# EAGLE design repeater2 (EAGLE 7.2.0)
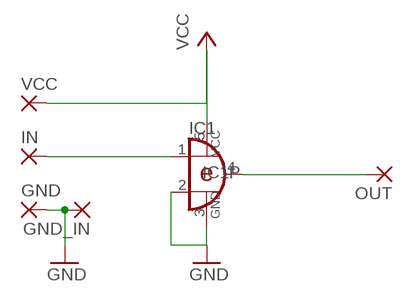
[diagram p0: schematic, sheet 1]

## Parts
GND  SMD2  [SMD1,27-2,54]
GND_IN  SMD2  [SMD1,27-2,54]
IC1  74AHC1G86DCK  [SC70-5]
IN  SMD2  [SMD1,27-2,54]
OUT  SMD2  [SMD1,27-2,54]
VCC  SMD2  [SMD1,27-2,54]

## Nets
GND: GND.1(P) GND_IN.1(P) IC1.2(I1) IC1.3(GND)
N$1: IC1.1(I0) IN.1(P)
N$2: IC1.4(O) OUT.1(P)
VCC: IC1.5(VCC) VCC.1(P)

## Library data of the parts
GND GND_IN IN OUT VCC = wirepad:SMD2: SMD PAD
IC1 = 74xx-little-de:74*1G86: 2-input EXCLUSIV-OR gate

## Board
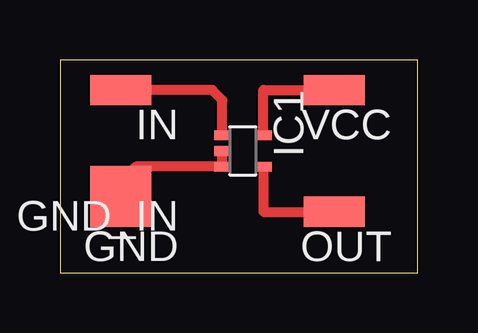
[diagram p1: board, top side]

Size 14.91 x 8.88 mm. Coordinates in mm from the lower left corner, seen from the top.
Outline: 0,0 14.91,0 14.91,8.88 0,8.88 0,0
Copper layers (1*16): Top 0.035mm / dielectric 1.5mm / Bottom 0.035mm
Design rules "default": minimum track width 10mil, minimum drill 24mil, track to track 8mil, track to pad 8mil, pad to pad 8mil, via to via 8mil, smd to smd 8mil, copper to edge 40mil, drill to drill 8mil, minimum pad ring 10mil, minimum via ring 8mil, stop-mask expansion 4mil, vias tented up to drill 0mil, thermal gap 10mil

### Footprints (pad centres in the part's own frame; a part is rotated, then mirrored left to right if it is on the bottom)
SMD1,27-2,54 = smd 1.27 x 2.54: 1 0,0
SC70-5 = smd 0.4 x 0.7: 1 -0.65,-0.85; 2 0,-0.85; 3 0.65,-0.85; 4 0.65,0.85; 5 -0.65,0.85

### Placement (x,y rotation side)
GND  2.54,2.54 90 top
GND_IN  2.54,3.81 90 top
IC1  7.62,5.08 270 top
IN  2.54,7.62 90 top
OUT  11.43,2.54 90 top
VCC  11.43,7.62 90 top

### Tracks (layer width: path | path; a pad name or v marks a point on that pad's centre or on a via)
GND
  Top 0.406: GND.1 GND_IN.1 3.16,4.43 IC1.3 IC1.2
N$1
  Top 0.406: IC1.1 6.77,7.2 6.35,7.62 IN.1
N$2
  Top 0.406: IC1.4 8.47,2.54 OUT.1
VCC
  Top 0.406: IC1.5 8.47,7.62 VCC.1